# Altium project Sensorbox.PrjPCB (part 1 of 2)
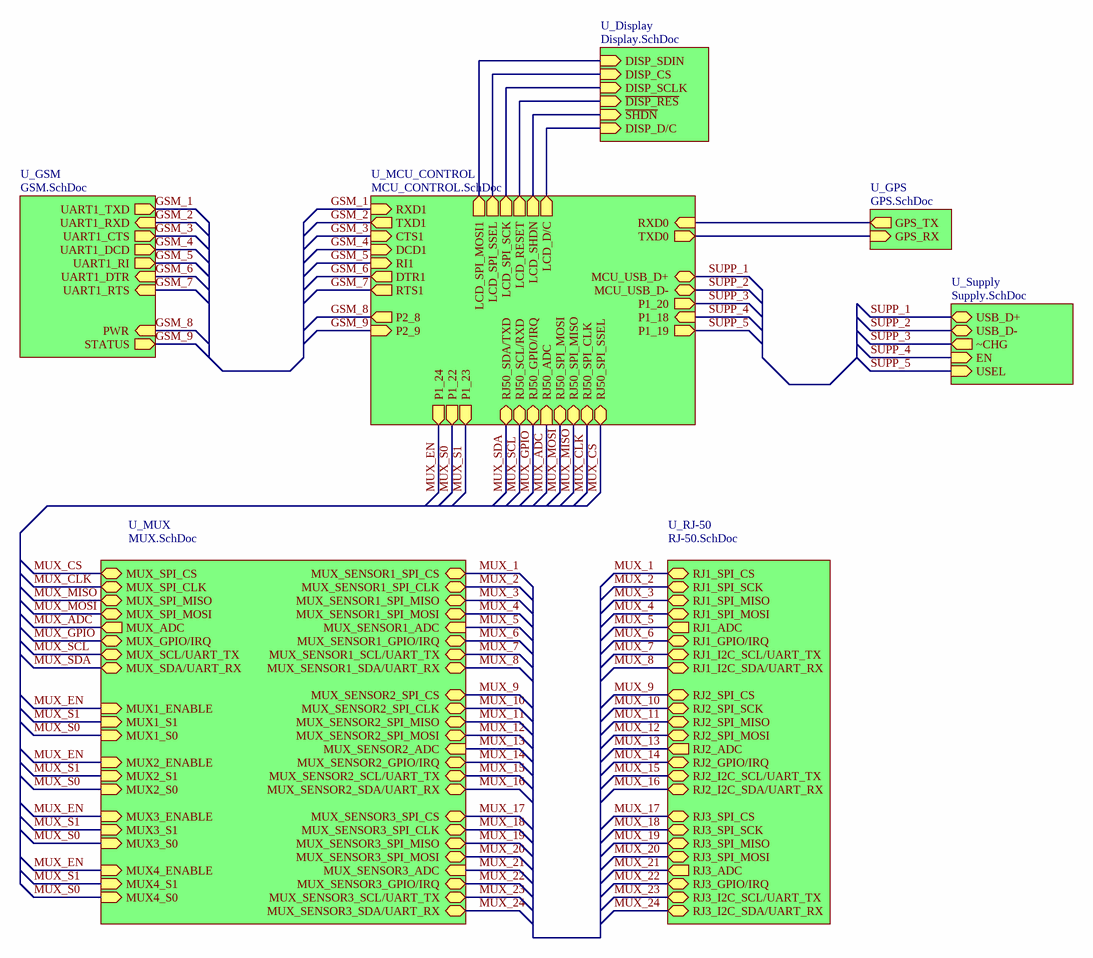
[diagram p0: Main_Scheet.SchDoc]
8 sheets, 160 parts. Net scope: hierarchical (ports join the sheet entries above them; power ports are global).
Board file: MeasureBox.PcbDoc
Sheets:
  Main_Scheet.SchDoc
    U_Supply = Supply.SchDoc
    U_RJ-50 = RJ-50.SchDoc
    U_MUX = MUX.SchDoc
    U_MCU_CONTROL = MCU_CONTROL.SchDoc
    U_GPS = GPS.SchDoc
    U_GSM = GSM.SchDoc
    U_Display = Display.SchDoc

## Sheet Main_Scheet.SchDoc: Main sheet
size 420 x 297 mm; DocumentNumber: 2; SheetNumber: 2; SheetTotal: 8

### Sub-sheets
U_Display = Display.SchDoc: ~{SHDN} (in), DISP_CS (in), ~{DISP_RES} (in), DISP_D/C (in), DISP_SCLK (in), DISP_SDIN (in)
U_GPS = GPS.SchDoc: GPS_RX (in), GPS_TX (out)
U_GSM = GSM.SchDoc: UART1_DCD (out), UART1_TXD (out), UART1_DTR (in), UART1_RI (out), UART1_RTS (in), UART1_RXD (in), UART1_CTS (out), STATUS (out), PWR (in)
U_MCU_CONTROL = MCU_CONTROL.SchDoc: TXD1 (out), RXD1 (in), CTS1 (in), DCD1 (in), DTR1 (out), RI1 (in), RTS1 (out), RXD0 (in), TXD0 (out), MCU_USB_D+ (bidir), MCU_USB_D- (bidir), P2_8 (out), RJ50_SPI_SSEL (bidir), P1_18 (in), P1_19 (out), P1_20 (out), RJ50_SCL/RXD (bidir), RJ50_SDA/TXD (bidir), RJ50_SPI_CLK (bidir), RJ50_SPI_MISO (bidir), RJ50_SPI_MOSI (bidir), RJ50_GPIO/IRQ (bidir), RJ50_ADC (in), P1_22 (out), P1_23 (out), P1_24 (out), P2_9 (in), LCD_D/C (out), LCD_RESET (out), LCD_SPI_SSEL (out), LCD_SPI_MOSI1 (out), LCD_SHDN (out), LCD_SPI_SCK (out)
U_MUX = MUX.SchDoc: MUX_SPI_CS (bidir), MUX_SENSOR1_SPI_CS (bidir), MUX_SENSOR2_SPI_CS (bidir), MUX_SENSOR3_SPI_CS (bidir), MUX_SENSOR1_SPI_CLK (bidir), MUX_SENSOR2_SPI_CLK (bidir), MUX_SENSOR3_SPI_CLK (bidir), MUX_SPI_CLK (bidir), MUX1_ENABLE (in), MUX1_S1 (in), MUX1_S0 (in), MUX_SPI_MISO (bidir), MUX_SENSOR1_SPI_MISO (bidir), MUX_SENSOR2_SPI_MISO (bidir), MUX_SENSOR3_SPI_MISO (bidir), MUX_SENSOR1_SPI_MOSI (bidir), MUX_SENSOR2_SPI_MOSI (bidir), MUX_SENSOR3_SPI_MOSI (bidir), MUX_SPI_MOSI (bidir), MUX2_ENABLE (in), MUX2_S1 (in), MUX2_S0 (in), MUX_ADC (out), MUX_SENSOR1_ADC (in), MUX_SENSOR2_ADC (in), MUX_SENSOR3_ADC (in), MUX_SENSOR1_GPIO/IRQ (bidir), MUX_SENSOR2_GPIO/IRQ (bidir), MUX_SENSOR3_GPIO/IRQ (bidir), MUX_GPIO/IRQ (bidir), MUX3_ENABLE (in), MUX3_S1 (in), MUX3_S0 (in), MUX_SCL/UART_TX (bidir), MUX_SENSOR1_SCL/UART_TX (bidir), MUX_SENSOR2_SCL/UART_TX (bidir), MUX_SENSOR3_SCL/UART_TX (bidir), MUX_SENSOR1_SDA/UART_RX (bidir), MUX_SENSOR2_SDA/UART_RX (bidir), MUX_SENSOR3_SDA/UART_RX (bidir), MUX_SDA/UART_RX (bidir), MUX4_ENABLE (in), MUX4_S1 (in), MUX4_S0 (in)
U_RJ-50 = RJ-50.SchDoc: RJ1_SPI_CS (bidir), RJ1_SPI_SCK (bidir), RJ1_SPI_MISO (bidir), RJ1_SPI_MOSI (bidir), RJ1_ADC (out), RJ1_I2C_SCL/UART_TX (bidir), RJ1_I2C_SDA/UART_RX (bidir), RJ1_GPIO/IRQ (bidir), RJ2_SPI_CS (bidir), RJ2_SPI_SCK (bidir), RJ2_SPI_MISO (bidir), RJ2_SPI_MOSI (bidir), RJ2_ADC (out), RJ2_I2C_SCL/UART_TX (bidir), RJ2_I2C_SDA/UART_RX (bidir), RJ2_GPIO/IRQ (bidir), RJ3_SPI_CS (bidir), RJ3_SPI_SCK (bidir), RJ3_SPI_MISO (bidir), RJ3_SPI_MOSI (bidir), RJ3_ADC (out), RJ3_I2C_SCL/UART_TX (bidir), RJ3_I2C_SDA/UART_RX (bidir), RJ3_GPIO/IRQ (bidir)
U_Supply = Supply.SchDoc: ~CHG (out), USEL (in), EN (in), USB_D- (bidir), USB_D+ (bidir)

### Nets
GSM_1: sheet U_MCU_CONTROL/RXD1, sheet U_GSM/UART1_TXD
GSM_2: sheet U_MCU_CONTROL/TXD1, sheet U_GSM/UART1_RXD
GSM_3: sheet U_MCU_CONTROL/CTS1, sheet U_GSM/UART1_CTS
GSM_4: sheet U_MCU_CONTROL/DCD1, sheet U_GSM/UART1_DCD
GSM_5: sheet U_MCU_CONTROL/RI1, sheet U_GSM/UART1_RI
GSM_6: sheet U_MCU_CONTROL/DTR1, sheet U_GSM/UART1_DTR
GSM_7: sheet U_MCU_CONTROL/RTS1, sheet U_GSM/UART1_RTS
GSM_8: sheet U_MCU_CONTROL/P2_8, sheet U_GSM/PWR
GSM_9: sheet U_MCU_CONTROL/P2_9, sheet U_GSM/STATUS
MUX_1: sheet U_RJ-50/RJ1_SPI_CS, sheet U_MUX/MUX_SENSOR1_SPI_CS
MUX_2: sheet U_RJ-50/RJ1_SPI_SCK, sheet U_MUX/MUX_SENSOR1_SPI_CLK
MUX_3: sheet U_RJ-50/RJ1_SPI_MISO, sheet U_MUX/MUX_SENSOR1_SPI_MISO
MUX_4: sheet U_RJ-50/RJ1_SPI_MOSI, sheet U_MUX/MUX_SENSOR1_SPI_MOSI
MUX_5: sheet U_RJ-50/RJ1_ADC, sheet U_MUX/MUX_SENSOR1_ADC
MUX_6: sheet U_RJ-50/RJ1_GPIO/IRQ, sheet U_MUX/MUX_SENSOR1_GPIO/IRQ
MUX_7: sheet U_RJ-50/RJ1_I2C_SCL/UART_TX, sheet U_MUX/MUX_SENSOR1_SCL/UART_TX
MUX_8: sheet U_RJ-50/RJ1_I2C_SDA/UART_RX, sheet U_MUX/MUX_SENSOR1_SDA/UART_RX
MUX_9: sheet U_RJ-50/RJ2_SPI_CS, sheet U_MUX/MUX_SENSOR2_SPI_CS
MUX_10: sheet U_RJ-50/RJ2_SPI_SCK, sheet U_MUX/MUX_SENSOR2_SPI_CLK
MUX_11: sheet U_RJ-50/RJ2_SPI_MISO, sheet U_MUX/MUX_SENSOR2_SPI_MISO
MUX_12: sheet U_RJ-50/RJ2_SPI_MOSI, sheet U_MUX/MUX_SENSOR2_SPI_MOSI
MUX_13: sheet U_RJ-50/RJ2_ADC, sheet U_MUX/MUX_SENSOR2_ADC
MUX_14: sheet U_RJ-50/RJ2_GPIO/IRQ, sheet U_MUX/MUX_SENSOR2_GPIO/IRQ
MUX_15: sheet U_RJ-50/RJ2_I2C_SCL/UART_TX, sheet U_MUX/MUX_SENSOR2_SCL/UART_TX
MUX_16: sheet U_RJ-50/RJ2_I2C_SDA/UART_RX, sheet U_MUX/MUX_SENSOR2_SDA/UART_RX
MUX_17: sheet U_RJ-50/RJ3_SPI_CS, sheet U_MUX/MUX_SENSOR3_SPI_CS
MUX_18: sheet U_RJ-50/RJ3_SPI_SCK, sheet U_MUX/MUX_SENSOR3_SPI_CLK
MUX_19: sheet U_RJ-50/RJ3_SPI_MISO, sheet U_MUX/MUX_SENSOR3_SPI_MISO
MUX_20: sheet U_RJ-50/RJ3_SPI_MOSI, sheet U_MUX/MUX_SENSOR3_SPI_MOSI
MUX_21: sheet U_RJ-50/RJ3_ADC, sheet U_MUX/MUX_SENSOR3_ADC
MUX_22: sheet U_RJ-50/RJ3_GPIO/IRQ, sheet U_MUX/MUX_SENSOR3_GPIO/IRQ
MUX_23: sheet U_RJ-50/RJ3_I2C_SCL/UART_TX, sheet U_MUX/MUX_SENSOR3_SCL/UART_TX
MUX_24: sheet U_RJ-50/RJ3_I2C_SDA/UART_RX, sheet U_MUX/MUX_SENSOR3_SDA/UART_RX
MUX_ADC: sheet U_MUX/MUX_ADC, sheet U_MCU_CONTROL/RJ50_ADC
MUX_CLK: sheet U_MUX/MUX_SPI_CLK, sheet U_MCU_CONTROL/RJ50_SPI_CLK
MUX_CS: sheet U_MUX/MUX_SPI_CS, sheet U_MCU_CONTROL/RJ50_SPI_SSEL
MUX_EN: sheet U_MUX/MUX1_ENABLE, sheet U_MUX/MUX2_ENABLE, sheet U_MUX/MUX3_ENABLE, sheet U_MUX/MUX4_ENABLE, sheet U_MCU_CONTROL/P1_24
MUX_GPIO: sheet U_MUX/MUX_GPIO/IRQ, sheet U_MCU_CONTROL/RJ50_GPIO/IRQ
MUX_MISO: sheet U_MUX/MUX_SPI_MISO, sheet U_MCU_CONTROL/RJ50_SPI_MISO
MUX_MOSI: sheet U_MUX/MUX_SPI_MOSI, sheet U_MCU_CONTROL/RJ50_SPI_MOSI
MUX_S0: sheet U_MUX/MUX1_S0, sheet U_MUX/MUX2_S0, sheet U_MUX/MUX3_S0, sheet U_MUX/MUX4_S0, sheet U_MCU_CONTROL/P1_22
MUX_S1: sheet U_MUX/MUX1_S1, sheet U_MUX/MUX2_S1, sheet U_MUX/MUX3_S1, sheet U_MUX/MUX4_S1, sheet U_MCU_CONTROL/P1_23
MUX_SCL: sheet U_MUX/MUX_SCL/UART_TX, sheet U_MCU_CONTROL/RJ50_SCL/RXD
MUX_SDA: sheet U_MUX/MUX_SDA/UART_RX, sheet U_MCU_CONTROL/RJ50_SDA/TXD
SUPP_1: sheet U_Supply/USB_D+, sheet U_MCU_CONTROL/MCU_USB_D+
SUPP_2: sheet U_Supply/USB_D-, sheet U_MCU_CONTROL/MCU_USB_D-
SUPP_3: sheet U_Supply/~CHG, sheet U_MCU_CONTROL/P1_20
SUPP_4: sheet U_Supply/EN, sheet U_MCU_CONTROL/P1_18
SUPP_5: sheet U_Supply/USEL, sheet U_MCU_CONTROL/P1_19
NetC42_2: sheet U_MCU_CONTROL/LCD_SHDN, sheet U_Display/~{SHDN}
NetCon4_8: sheet U_MCU_CONTROL/LCD_SPI_SSEL, sheet U_Display/DISP_CS
NetCon4_9: sheet U_MCU_CONTROL/LCD_RESET, sheet U_Display/~{DISP_RES}
NetCon4_10: sheet U_MCU_CONTROL/LCD_D/C, sheet U_Display/DISP_D/C
NetCon4_13: sheet U_MCU_CONTROL/LCD_SPI_SCK, sheet U_Display/DISP_SCLK
NetCon4_14: sheet U_MCU_CONTROL/LCD_SPI_MOSI1, sheet U_Display/DISP_SDIN
NetR48_2: sheet U_MCU_CONTROL/TXD0, sheet U_GPS/GPS_RX
NetR49_2: sheet U_MCU_CONTROL/RXD0, sheet U_GPS/GPS_TX

### Notes on the sheet
- Project/Equipment
- Document
- Sensorbox
- Designer
- Drawn by
- Check.by
- Copyright Creotech Instruments SA 2014.
  This documentation describes Open Hardware and is licensed under the CERN OHL v.1.1. You may redistribute and modify this documentation under the terms of the CERN OHL v.1.1. (http://ohwr.org/CERNOHL). This documentation is distributed WITHOUT ANY EXPRESS OR IMPLIED WARRANTY, INCLUDING OF MERCHANTABILITY, SATISFACTORY QUALITY AND FITNESS FOR A PARTICULAR PURPOSE. Please see the CERN OHL v.1.1 for applicable conditions.
- CTI
- Creotech Instruments S.A.
- File
- Last Mod.
- Print Date
- Sheet
- Size
- A3
- of
- Rev

## Sheet Supply.SchDoc: Supply
size 420 x 297 mm; DocumentNumber: 6; SheetNumber: 6; SheetTotal: 8
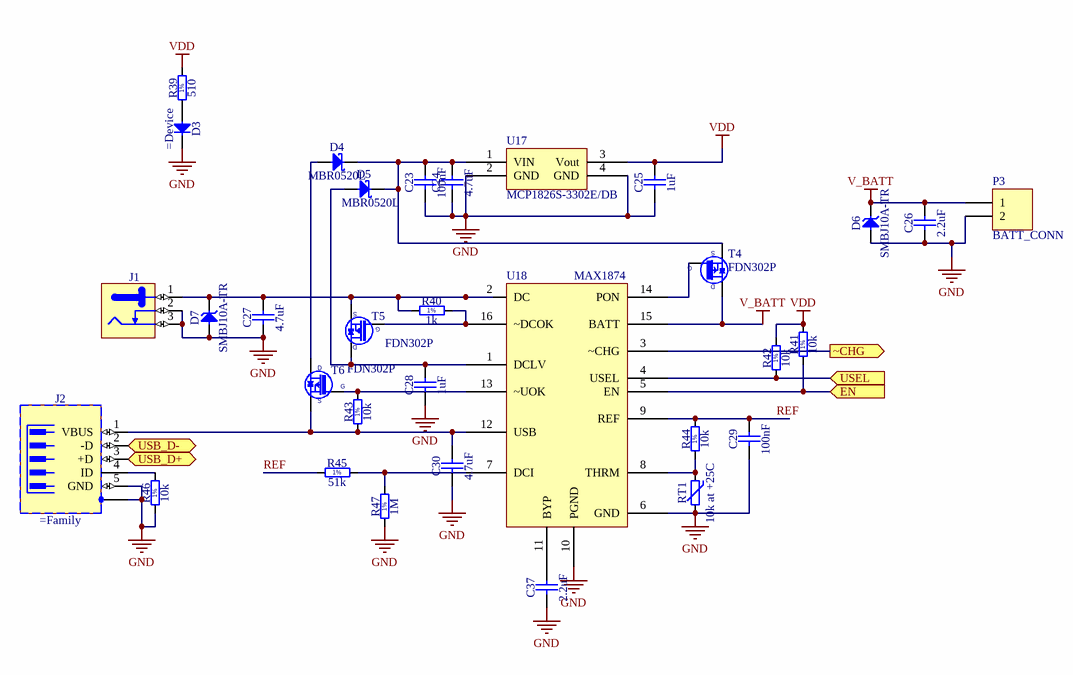
[diagram p1: Supply.SchDoc]

### Parts
C23  100nF  [CAPC1608X87N]
C24  4.7uF  [CAPC1608X87N]
C25  1uF  [CAPC1608X87N]
C26  2.2uF  [CAPC1608X87N]
C27  4.7uF  [CAPC1608X87N]
C28  1uF  [CAPC1608X87N]
C29  100nF  [CAPC1608X87N]
C30  4.7uF  [CAPC1608X87N]
C37  2.2uF  [CAPC1608X87N]
D3  (no value)  [LED_DIODE_0603]
D4  MBR0520L  [SCHOTTKY_SOD123]
D5  MBR0520L  [SCHOTTKY_SOD123]
D6  SMBJ10A-TR  [DO-214AA]
D7  SMBJ10A-TR  [DO-214AA]
J1  Jack  [CLIFF_FC68148(DC-10A)]  (value not drawn)
J2  (no value)  [Micro USB]
P3  BATT_CONN  [HDR1X2]
R39  510  [RESC1608X55N]
R40  1k  [RESC1608X55N]
R41  10k  [RESC1608X55N]
R42  10k  [RESC1608X55N]
R43  10k  [RESC1608X55N]
R44  10k  [RESC1608X55N]
R45  51k  [RESC1608X55N]
R46  10k  [RESC1608X55N]
R47  1M  [RESC1608X55N]
RT1  10k at +25C  [termistor]
T4  FDN302P  [FDN302P]
T5  FDN302P  [FDN302P]
T6  FDN302P  [FDN302P]
U17  MCP1826S-3302E/DB  [MCP1826S-3302E/DB]
U18  MAX1874  [TQFN 5x5/16-l]

### Ports
EN (in), USB_D+ (bidir), USB_D- (bidir), USEL (in), ~CHG (out)

### Nets
GND: C23.1 C24.1 C25.1 C26.1 C27.1 C28.1 C29.1 C30.1 C37.1 D3.1(C) D6.2(A) D7.2(A) J1.2 J1.3 J2.5(GND) J2.6(SH) P3.2 R46.1 R47.1 RT1.1 U17.2(GND) U17.4(GND) U18.6(GND) U18.10(PGND)
V_BATT: C26.2 D6.1(C) P3.1 T4.3(D) U18.15(BATT)
VDD: C25.2 R39.2 R41.2 R42.2 U17.3(Vout)
REF: C29.2 R44.2 R45.1 U18.9(REF)
SUPP_1: J2.3(+D) ; port USB_D+
SUPP_2: J2.2(-D) ; port USB_D-
SUPP_3: U18.3(~CHG) ; port ~CHG
SUPP_4: R41.1 U18.5(EN) ; port EN
SUPP_5: R42.1 U18.4(USEL) ; port USEL
NetC23_2: C23.2 C24.2 D4.1(C) D5.1(C) T4.2(S) U17.1(VIN)
NetC27_2: C27.2 D7.1(C) J1.1 R40.1 T5.2(S) U18.2(DC)
NetC28_2: C28.2 D5.2(A) T5.3(D) U18.1(DCLV)
NetC30_2: C30.2 J2.1(VBUS) R43.1 T6.2(S) U18.12(USB)
NetC37_2: C37.2 U18.11(BYP)
NetD3_2: D3.2(A) R39.1
NetD4_2: D4.2(A) T6.3(D)
NetJ2_4: J2.4(ID) R46.2
NetR40_2: R40.2 T5.1(G) U18.16(~DCOK)
NetR43_2: R43.2 T6.1(G) U18.13(~UOK)
NetR44_1: R44.1 RT1.2 U18.8(THRM)
NetR45_2: R45.2 R47.2 U18.7(DCI)
NetT4_1: T4.1(G) U18.14(PON)

### Notes on the sheet
- Project/Equipment
- Document
- Sensorbox
- Designer
- Drawn by
- Check.by
- Copyright Creotech Instruments SA 2014.
  This documentation describes Open Hardware and is licensed under the CERN OHL v.1.1. You may redistribute and modify this documentation under the terms of the CERN OHL v.1.1. (http://ohwr.org/CERNOHL). This documentation is distributed WITHOUT ANY EXPRESS OR IMPLIED WARRANTY, INCLUDING OF MERCHANTABILITY, SATISFACTORY QUALITY AND FITNESS FOR A PARTICULAR PURPOSE. Please see the CERN OHL v.1.1 for applicable conditions.
- CTI
- Creotech Instruments S.A.
- File
- Last Mod.
- Print Date
- Sheet
- Size
- A3
- of
- Rev
- (in symbol R0603_1K_1%_0.1W_100PPM) 1%
- (in symbol R0603_1M_1%_0.1W_100PPM) 1%
- (in symbol R0603_10K_1%_0.1W_100PPM) 1%
- (in symbol R0603_51K_1%_0.1W_100PPM) 1%
- (in symbol R0603_510R_1%_0.1W_100PPM) 1%

### Library data of the parts
C23 C29 = CC0603_100NF_50V_10%_X7R: Non-polarised capacitor; Part Description: SMD Multilayer Chip Ceramic Capacitor; Manufacturer: GENERIC; Manufacturer1 Part Number: 223858615649; Voltage: 50V; TC: X7R; Tolerance: ±10%; Table: Capacitors SMD; Part Number: CC0603_100NF_50V_10%_X7R; Component Kind: Standard; Component Type: Standard; Pin Count: 2; Value: 100nF; Status: Preferred; Manufacturer Part Number: CC0603_100NF_50V_10%_X7R; Case: 0603; Mounted: Yes; Socket: No; SMD: Yes; Manufacturer1 Example: PHYCOMP; Manufacturer1 ComponentHeight: 0.87mm; HelpURL: \\cern.ch\dfs\Applications\Altium\Datasheets\CC0603_X7R_PHYCOMP.pdf; Author: CERN DEM JLC; CreateDate: 2007-12-03; LatestRevisionDate: 2007-12-03
C24 C30 = CC0603_4.7UF_6.3V_10%_X5R: Non-polarised capacitor; Part Description: SMD Multilayer Chip Ceramic Capacitor; Manufacturer: GENERIC; Manufacturer1 Part Number: 225520613672; Voltage: 6.3V; TC: X5R; Tolerance: ±10%; Table: Capacitors SMD; Part Number: CC0603_4.7UF_6.3V_10%_X5R; Component Kind: Standard; Component Type: Standard; Pin Count: 2; Value: 4.7uF; Status: Preferred; Manufacturer Part Number: CC0603_4.7uF_6.3V_10%_X5R; Case: 0603; Mounted: Yes; Socket: No; SMD: Yes; Manufacturer1 Example: PHYCOMP; Manufacturer1 ComponentHeight: 0.87mm; HelpURL: \\cern.ch\dfs\Applications\Altium\Datasheets\CC0805_X5R_PHYCOMP_HC.pdf; Author: CERN DEM JLC; CreateDate: 2007-12-03; LatestRevisionDate: 2007-12-03
C25 C28 = CC0603_1UF_16V_10%_X7R: Non-polarised capacitor; Part Description: SMD Multilayer Chip Ceramic Capacitor; Manufacturer: GENERIC; Manufacturer1 Part Number: 223824613663; Voltage: 16V; TC: X7R; Tolerance: ±10%; Table: Capacitors SMD; Part Number: CC0603_1UF_16V_10%_X7R; Component Kind: Standard; Component Type: Standard; Pin Count: 2; Value: 1uF; Status: Preferred; Manufacturer Part Number: CC0603_1uF_16V_10%_X7R; Case: 0603; Mounted: Yes; Socket: No; SMD: Yes; Manufacturer1 Example: PHYCOMP; Manufacturer1 ComponentHeight: 0.87mm; HelpURL: \\cern.ch\dfs\Applications\Altium\Datasheets\CC0805_X5R_PHYCOMP_HC.pdf; Author: CERN DEM JLC; CreateDate: 2007-12-03; LatestRevisionDate: 2007-12-03
C26 = CC0603_2.2UF_6.3V_10%_X5R: Non-polarised capacitor; Part Description: SMD Multilayer Chip Ceramic Capacitor; Manufacturer: GENERIC; Manufacturer1 Part Number: 225520613667; Voltage: 6.3V; TC: X5R; Tolerance: ±10%; Table: Capacitors SMD; Part Number: CC0603_2.2UF_6.3V_10%_X5R; Component Kind: Standard; Component Type: Standard; Pin Count: 2; Value: 2.2uF; Status: Preferred; Manufacturer Part Number: CC0603_2.2uF_6.3V_10%_X5R; Case: 0603; Mounted: Yes; Socket: No; SMD: Yes; Manufacturer1 Example: PHYCOMP; Manufacturer1 ComponentHeight: 0.87mm; HelpURL: \\cern.ch\dfs\Applications\Altium\Datasheets\CC0805_X5R_PHYCOMP_HC.pdf; Author: CERN DEM JLC; CreateDate: 2007-12-03; LatestRevisionDate: 2007-12-03
C27 = CC0603_4.7UF_6.3V_10%_X5R: Non-polarised capacitor; Part Description: SMD Multilayer Chip Ceramic Capacitor; Manufacturer: GENERIC; Manufacturer1 Part Number: 225520613672; Voltage: 25V; TC: X5R; Tolerance: ±10%; Table: Capacitors SMD; Part Number: CC0603_4.7UF_6.3V_10%_X5R; Component Kind: Standard; Component Type: Standard; Pin Count: 2; Value: 4.7uF; Status: Preferred; Manufacturer Part Number: CC0603_4.7uF_6.3V_10%_X5R; Case: 0603; Mounted: Yes; Socket: No; SMD: Yes; Manufacturer1 Example: PHYCOMP; Manufacturer1 ComponentHeight: 0.87mm; HelpURL: \\cern.ch\dfs\Applications\Altium\Datasheets\CC0805_X5R_PHYCOMP_HC.pdf; Author: CERN DEM JLC; CreateDate: 2007-12-03; LatestRevisionDate: 2007-12-03
C37 = CC0603_2.2UF_16V_10%_X5R: Non-polarised capacitor; Part Description: SMD Multilayer Chip Ceramic Capacitor; Manufacturer: GENERIC; Manufacturer1 Part Number: CC0603KRX5R7BB225; Voltage: 16V; TC: X5R; Tolerance: ±10%; Table: Capacitors SMD; Part Number: CC0603_2.2UF_16V_10%_X5R; Component Kind: Standard; Component Type: Standard; Pin Count: 2; Value: 2.2uF; Status: Preferred; Manufacturer Part Number: CC0603_2.2UF_16V_10%_X5R; Case: 0603; Mounted: Yes; Socket: No; SMD: Yes; Manufacturer1 Example: YAGEO; Manufacturer1 ComponentHeight: 0.9mm; HelpURL: \\cern.ch\dfs\Applications\Altium\Datasheets\CC0805_X5R_PHYCOMP_HC.pdf; Author: CERN DEM JLC; CreateDate: 2011-04-28; LatestRevisionDate: 2011-04-28
D3 = Diode
D4 D5 = Diode Schottky: Schottky Diode
D6 D7 = Diode TVS Uni-Directional: Transient Voltage Suppressor Diode (Uni-Directional)
J1 = CLIFF_FC68148(DC-10A): 12V /  5A, 2.1mm Diameter Pin, DC Power Socket With  Switch. DC10A Type; Part Description: 12V/5A, 2.1mm Diameter Pin, DC Power Socket With  Switch (DC10A Type); Manufacturer: CLIFF ELECTRONIC COMPONENTS; Table: Miscellaneous; Part Number: CLIFF_FC68148(DC-10A); Component Kind: Standard; Component Type: Standard; Pin Count: 3; Family: Jack; Mounted: Yes; Socket: No; SMD: No; Status: None; Manufacturer Part Number: FC68148 (DC-10A); ComponentHeight: 11mm; HelpURL: \\cern.ch\dfs\Applications\Altium\Datasheets\CLIFF_FC68148(DC-10A).pdf; Author: CERN DEM JLC; CreateDate: 2010-11-23; LatestRevisionDate: 2010-11-23
J2 = Connector USB 5 Pin + 1Shield: MOLEX - 47346-0001 - MICRO USB TYPE B
P3 = Header 2: Header, 2-Pin; LatestRevisionDate: 17-Jul-2002; LatestRevisionNote: Re-released for DXP Platform.; Publisher: Altium Limited
R39 = R0603_510R_1%_0.1W_100PPM: Resistor - 1%; Part Description: General Purpose Thick Film Chip Resistor; Manufacturer: GENERIC; Manufacturer1 Part Number: NRC06F5100TRF; Power: 0.1W; TC: ±100ppm/°C; Table: Resistors SMD; Part Number: R0603_510R_1%_0.1W_100PPM; Component Kind: Standard; Component Type: Standard; Pin Count: 2; Value: 510; Status: Preferred; Tolerance: ±1%; Manufacturer Part Number: R0603_510R_1%_0.1W_100PPM; Case: 0603; Mounted: Yes; Socket: No; SMD: Yes; Manufacturer1 Example: NIC COMPONENT; Manufacturer1 ComponentHeight: 0.55mm; HelpURL: \\cern.ch\dfs\Applications\Altium\Datasheets\R0603_NIC_NRC.pdf; Author: CERN DEM JLC; CreateDate: 2007-12-03; LatestRevisionDate: 2008-03-13
R40 = R0603_1K_1%_0.1W_100PPM: Resistor - 1%; Part Description: General Purpose Thick Film Chip Resistor; Manufacturer: GENERIC; Manufacturer1 Part Number: NRC06F1001TRF; Power: 0.1W; TC: ±100ppm/°C; Table: Resistors SMD; Part Number: R0603_1K_1%_0.1W_100PPM; Component Kind: Standard; Component Type: Standard; Pin Count: 2; Value: 1k; Status: Preferred; Tolerance: ±1%; Manufacturer Part Number: R0603_1K_1%_0.1W_100PPM; Case: 0603; Mounted: Yes; Socket: No; SMD: Yes; Manufacturer1 Example: NIC COMPONENT; Manufacturer1 ComponentHeight: 0.55mm; HelpURL: \\cern.ch\dfs\Applications\Altium\Datasheets\R0603_NIC_NRC.pdf; Author: CERN DEM JLC; CreateDate: 2007-12-03; LatestRevisionDate: 2008-03-13
R41-R44 R46 = R0603_10K_1%_0.1W_100PPM: Resistor - 1%; Part Description: General Purpose Thick Film Chip Resistor; Manufacturer: GENERIC; Manufacturer1 Part Number: NRC06F1002TRF; Power: 0.1W; TC: ±100ppm/°C; Table: Resistors SMD; Part Number: R0603_10K_1%_0.1W_100PPM; Component Kind: Standard; Component Type: Standard; Pin Count: 2; Value: 10k; Status: Preferred; Tolerance: ±1%; Manufacturer Part Number: R0603_10K_1%_0.1W_100PPM; Case: 0603; Mounted: Yes; Socket: No; SMD: Yes; Manufacturer1 Example: NIC COMPONENT; Manufacturer1 ComponentHeight: 0.55mm; HelpURL: \\cern.ch\dfs\Applications\Altium\Datasheets\R0603_NIC_NRC.pdf; Author: CERN DEM JLC; CreateDate: 2007-12-03; LatestRevisionDate: 2008-03-13
R45 = R0603_51K_1%_0.1W_100PPM: Resistor - 1%; Part Description: General Purpose Thick Film Chip Resistor; Manufacturer: GENERIC; Manufacturer1 Part Number: NRC06F5102TRF; Power: 0.1W; TC: ±100ppm/°C; Table: Resistors SMD; Part Number: R0603_51K_1%_0.1W_100PPM; Component Kind: Standard; Component Type: Standard; Pin Count: 2; Value: 51k; Status: Preferred; Tolerance: ±1%; Manufacturer Part Number: R0603_51K_1%_0.1W_100PPM; Case: 0603; Mounted: Yes; Socket: No; SMD: Yes; Manufacturer1 Example: NIC COMPONENT; Manufacturer1 ComponentHeight: 0.55mm; HelpURL: \\cern.ch\dfs\Applications\Altium\Datasheets\R0603_NIC_NRC.pdf; Author: CERN DEM JLC; CreateDate: 2007-12-03; LatestRevisionDate: 2008-03-13
R47 = R0603_1M_1%_0.1W_100PPM: Resistor - 1%; Part Description: General Purpose Thick Film Chip Resistor; Manufacturer: GENERIC; Manufacturer1 Part Number: NRC06F1004TRF; Power: 0.1W; TC: ±100ppm/°C; Table: Resistors SMD; Part Number: R0603_1M_1%_0.1W_100PPM; Component Kind: Standard; Component Type: Standard; Pin Count: 2; Value: 1M; Status: Preferred; Tolerance: ±1%; Manufacturer Part Number: R0603_1M_1%_0.1W_100PPM; Case: 0603; Mounted: Yes; Socket: No; SMD: Yes; Manufacturer1 Example: NIC COMPONENT; Manufacturer1 ComponentHeight: 0.55mm; HelpURL: \\cern.ch\dfs\Applications\Altium\Datasheets\R0603_NIC_NRC.pdf; Author: CERN DEM JLC; CreateDate: 2007-12-03; LatestRevisionDate: 2008-03-13
RT1 = Thermistor NTC: Thermistor NTC (Negative Temperature Coefficient)
T4-T6 = P-MOS FDN302P: P-Channel 2.5V Specified PowerTrench? MOSFET
U17 = MCP1826S-3302E/DB Microchip LDO Regulator: Microchip LDO Regulator
U18 = MAX1874 - Battery charger: MAX1874 Dual input battery charger

## Sheet RJ-50.SchDoc: RJ-50
size 420 x 297 mm; DocumentNumber: 5; SheetNumber: 5; SheetTotal: 8
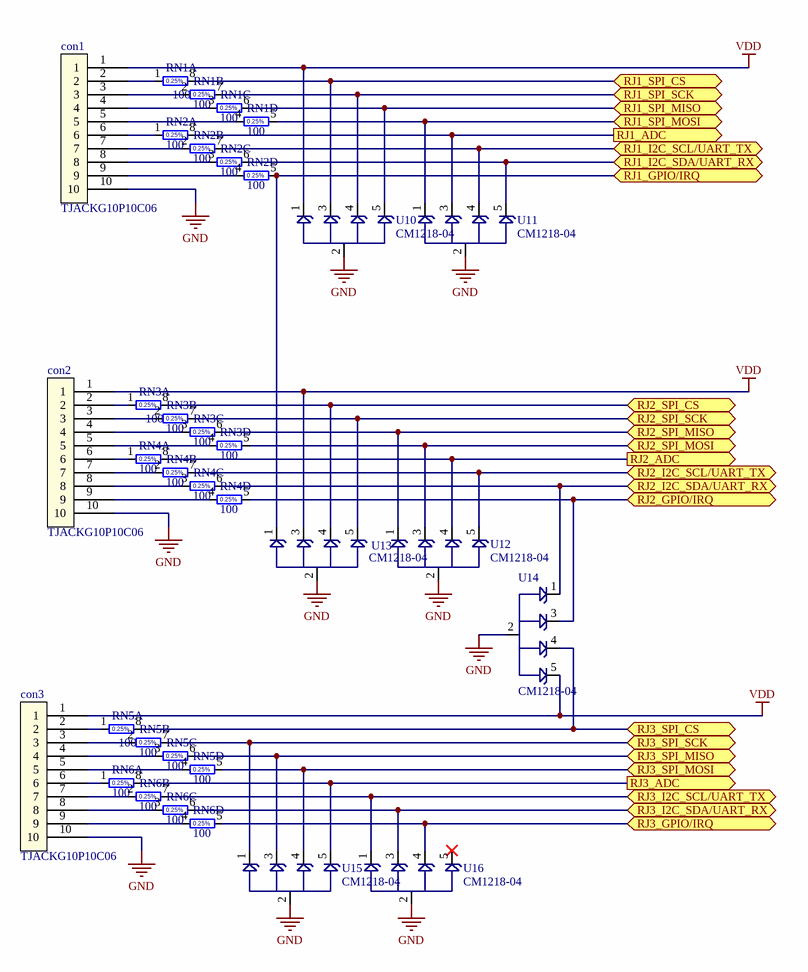
[diagram p2: RJ-50.SchDoc]

### Parts
con1  TJACKG10P10C06  [RJ-50 TJACKG10P10C06]
con2  TJACKG10P10C06  [RJ-50 TJACKG10P10C06]
con3  TJACKG10P10C06  [RJ-50 TJACKG10P10C06]
RN1  100  [RN_VISHAY_ACAS0612]  (parts A,B,C,D of 4)
RN2  100  [RN_VISHAY_ACAS0612]  (parts A,B,C,D of 4)
RN3  100  [RN_VISHAY_ACAS0612]  (parts A,B,C,D of 4)
RN4  100  [RN_VISHAY_ACAS0612]  (parts A,B,C,D of 4)
RN5  100  [RN_VISHAY_ACAS0612]  (parts A,B,C,D of 4)
RN6  100  [RN_VISHAY_ACAS0612]  (parts A,B,C,D of 4)
U10  CM1218-04  [ESD PROTECTOR]
U11  CM1218-04  [ESD PROTECTOR]
U12  CM1218-04  [ESD PROTECTOR]
U13  CM1218-04  [ESD PROTECTOR]
U14  CM1218-04  [ESD PROTECTOR]
U15  CM1218-04  [ESD PROTECTOR]
U16  CM1218-04  [ESD PROTECTOR]

### Ports
RJ1_ADC (out), RJ1_GPIO/IRQ (bidir), RJ1_I2C_SCL/UART_TX (bidir), RJ1_I2C_SDA/UART_RX (bidir), RJ1_SPI_CS (bidir), RJ1_SPI_MISO (bidir), RJ1_SPI_MOSI (bidir), RJ1_SPI_SCK (bidir), RJ2_ADC (out), RJ2_GPIO/IRQ (bidir), RJ2_I2C_SCL/UART_TX (bidir), RJ2_I2C_SDA/UART_RX (bidir), RJ2_SPI_CS (bidir), RJ2_SPI_MISO (bidir), RJ2_SPI_MOSI (bidir), RJ2_SPI_SCK (bidir), RJ3_ADC (out), RJ3_GPIO/IRQ (bidir), RJ3_I2C_SCL/UART_TX (bidir), RJ3_I2C_SDA/UART_RX (bidir), RJ3_SPI_CS (bidir), RJ3_SPI_MISO (bidir), RJ3_SPI_MOSI (bidir), RJ3_SPI_SCK (bidir)

### Nets
GND: con1.10 con2.10 con3.10 U10.2 U11.2 U12.2 U13.2 U14.2 U15.2 U16.2
VDD: con1.1 con2.1 con3.1 U10.1 U13.3 U14.5
MUX_1: RN1.8 U10.3 ; port RJ1_SPI_CS
MUX_2: RN1.7 U10.4 ; port RJ1_SPI_SCK
MUX_3: RN1.6 U10.5 ; port RJ1_SPI_MISO
MUX_4: RN1.5 U11.1 ; port RJ1_SPI_MOSI
MUX_5: RN2.8 U11.3 ; port RJ1_ADC
MUX_6: RN2.5 U13.1 ; port RJ1_GPIO/IRQ
MUX_7: RN2.7 U11.4 ; port RJ1_I2C_SCL/UART_TX
MUX_8: RN2.6 U11.5 ; port RJ1_I2C_SDA/UART_RX
MUX_9: RN3.8 U13.4 ; port RJ2_SPI_CS
MUX_10: RN3.7 U13.5 ; port RJ2_SPI_SCK
MUX_11: RN3.6 U12.1 ; port RJ2_SPI_MISO
MUX_12: RN3.5 U12.3 ; port RJ2_SPI_MOSI
MUX_13: RN4.8 U12.4 ; port RJ2_ADC
MUX_14: RN4.5 U14.3 ; port RJ2_GPIO/IRQ
MUX_15: RN4.7 U12.5 ; port RJ2_I2C_SCL/UART_TX
MUX_16: RN4.6 U14.1 ; port RJ2_I2C_SDA/UART_RX
MUX_17: RN5.8 U14.4 ; port RJ3_SPI_CS
MUX_18: RN5.7 U15.1 ; port RJ3_SPI_SCK
MUX_19: RN5.6 U15.3 ; port RJ3_SPI_MISO
MUX_20: RN5.5 U15.4 ; port RJ3_SPI_MOSI
MUX_21: RN6.8 U15.5 ; port RJ3_ADC
MUX_22: RN6.5 U16.4 ; port RJ3_GPIO/IRQ
MUX_23: RN6.7 U16.1 ; port RJ3_I2C_SCL/UART_TX
MUX_24: RN6.6 U16.3 ; port RJ3_I2C_SDA/UART_RX
Netcon1_2: con1.2 RN1.1
Netcon1_3: con1.3 RN1.2
Netcon1_4: con1.4 RN1.3
Netcon1_5: con1.5 RN1.4
Netcon1_6: con1.6 RN2.1
Netcon1_7: con1.7 RN2.2
Netcon1_8: con1.8 RN2.3
Netcon1_9: con1.9 RN2.4
Netcon2_2: con2.2 RN3.1
Netcon2_3: con2.3 RN3.2
Netcon2_4: con2.4 RN3.3
Netcon2_5: con2.5 RN3.4
Netcon2_6: con2.6 RN4.1
Netcon2_7: con2.7 RN4.2
Netcon2_8: con2.8 RN4.3
Netcon2_9: con2.9 RN4.4
Netcon3_2: con3.2 RN5.1
Netcon3_3: con3.3 RN5.2
Netcon3_4: con3.4 RN5.3
Netcon3_5: con3.5 RN5.4
Netcon3_6: con3.6 RN6.1
Netcon3_7: con3.7 RN6.2
Netcon3_8: con3.8 RN6.3
Netcon3_9: con3.9 RN6.4

Not connected (* = marked no-connect by the designer): U16 5*

### Notes on the sheet
- Project/Equipment
- Document
- Sensorbox
- Designer
- Drawn by
- Check.by
- Copyright Creotech Instruments SA 2014.
  This documentation describes Open Hardware and is licensed under the CERN OHL v.1.1. You may redistribute and modify this documentation under the terms of the CERN OHL v.1.1. (http://ohwr.org/CERNOHL). This documentation is distributed WITHOUT ANY EXPRESS OR IMPLIED WARRANTY, INCLUDING OF MERCHANTABILITY, SATISFACTORY QUALITY AND FITNESS FOR A PARTICULAR PURPOSE. Please see the CERN OHL v.1.1 for applicable conditions.
- CTI
- Creotech Instruments S.A.
- File
- Last Mod.
- Print Date
- Sheet
- Size
- A3
- of
- Rev
- (in symbol RN_100R_VISHAY_ACASA1000E1000P100, part A) 0.25%
- (in symbol RN_100R_VISHAY_ACASA1000E1000P100, part B) 0.25%
- (in symbol RN_100R_VISHAY_ACASA1000E1000P100, part C) 0.25%
- (in symbol RN_100R_VISHAY_ACASA1000E1000P100, part D) 0.25%

### Library data of the parts
con1-con3 = TJACKG10P10C06 (RJ50 - Female connector)
RN1-RN6 = RN_100R_VISHAY_ACASA1000E1000P100: DIL8 Resistor Network 4 Isolated Resistor 0.25%; Part Description: Chip Resistor Array , 4 Isolated Resistor (Convex Terminal), ACAS 0612 Serie; Manufacturer: VISHAY  BEYSCHLAG; Power: 0.1W; TC: ±25ppm/°C; Table: Resistor Networks SMD; Part Number: RN_100R_VISHAY_ACASA1000E1000P100; Component Kind: Standard; Component Type: Standard; Pin Count: 8; Value: 100; Tolerance: ±0.25%; Manufacturer Part Number: ACASA1000E1000P100; Case: 1206; Mounted: Yes; Socket: No; SMD: Yes; ComponentHeight: 0.55mm; HelpURL: \\cern.ch\dfs\Applications\Altium\Datasheets\RN_VISHAY_ACAS0612.pdf; Author: CERN DEM JLC; CreateDate: 2011-05-12; LatestRevisionDate: 2011-05-12
U10-U16 = CM1218-04 ESD_Protector

## Sheet MUX.SchDoc: MUX
size 420 x 297 mm; DocumentNumber: 4; SheetNumber: 4; SheetTotal: 8
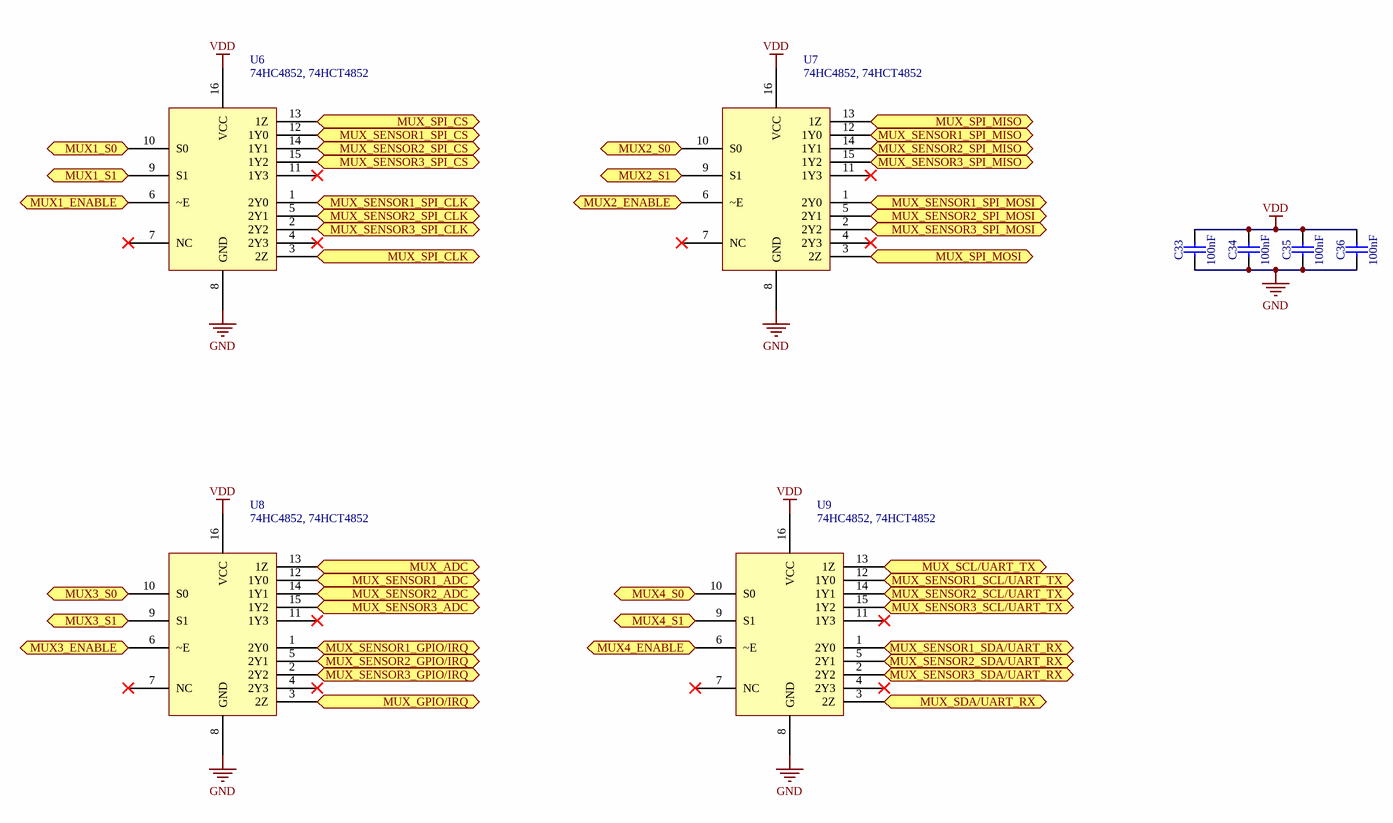
[diagram p3: MUX.SchDoc]

### Parts
C33  100nF  [CAPC1608X87N]
C34  100nF  [CAPC1608X87N]
C35  100nF  [CAPC1608X87N]
C36  100nF  [CAPC1608X87N]
U6  74HC4852, 74HCT4852  [TSSOP16]
U7  74HC4852, 74HCT4852  [TSSOP16]
U8  74HC4852, 74HCT4852  [TSSOP16]
U9  74HC4852, 74HCT4852  [TSSOP16]

### Ports
MUX1_ENABLE (in), MUX1_S0 (in), MUX1_S1 (in), MUX2_ENABLE (in), MUX2_S0 (in), MUX2_S1 (in), MUX3_ENABLE (in), MUX3_S0 (in), MUX3_S1 (in), MUX4_ENABLE (in), MUX4_S0 (in), MUX4_S1 (in), MUX_ADC (out), MUX_GPIO/IRQ (bidir), MUX_SCL/UART_TX (bidir), MUX_SDA/UART_RX (bidir), MUX_SENSOR1_ADC (in), MUX_SENSOR1_GPIO/IRQ (bidir), MUX_SENSOR1_SCL/UART_TX (bidir), MUX_SENSOR1_SDA/UART_RX (bidir), MUX_SENSOR1_SPI_CLK (bidir), MUX_SENSOR1_SPI_CS (bidir), MUX_SENSOR1_SPI_MISO (bidir), MUX_SENSOR1_SPI_MOSI (bidir), MUX_SENSOR2_ADC (in), MUX_SENSOR2_GPIO/IRQ (bidir), MUX_SENSOR2_SCL/UART_TX (bidir), MUX_SENSOR2_SDA/UART_RX (bidir), MUX_SENSOR2_SPI_CLK (bidir), MUX_SENSOR2_SPI_CS (bidir), MUX_SENSOR2_SPI_MISO (bidir), MUX_SENSOR2_SPI_MOSI (bidir), MUX_SENSOR3_ADC (in), MUX_SENSOR3_GPIO/IRQ (bidir), MUX_SENSOR3_SCL/UART_TX (bidir), MUX_SENSOR3_SDA/UART_RX (bidir), MUX_SENSOR3_SPI_CLK (bidir), MUX_SENSOR3_SPI_CS (bidir), MUX_SENSOR3_SPI_MISO (bidir), MUX_SENSOR3_SPI_MOSI (bidir), MUX_SPI_CLK (bidir), MUX_SPI_CS (bidir), MUX_SPI_MISO (bidir), MUX_SPI_MOSI (bidir)

### Nets
GND: C33.1 C34.1 C35.1 C36.1 U6.8(GND) U7.8(GND) U8.8(GND) U9.8(GND)
VDD: C33.2 C34.2 C35.2 C36.2 U6.16(VCC) U7.16(VCC) U8.16(VCC) U9.16(VCC)
MUX_1: U6.12(1Y0) ; port MUX_SENSOR1_SPI_CS
MUX_2: U6.1(2Y0) ; port MUX_SENSOR1_SPI_CLK
MUX_3: U7.12(1Y0) ; port MUX_SENSOR1_SPI_MISO
MUX_4: U7.1(2Y0) ; port MUX_SENSOR1_SPI_MOSI
MUX_5: U8.12(1Y0) ; port MUX_SENSOR1_ADC
MUX_6: U8.1(2Y0) ; port MUX_SENSOR1_GPIO/IRQ
MUX_7: U9.12(1Y0) ; port MUX_SENSOR1_SCL/UART_TX
MUX_8: U9.1(2Y0) ; port MUX_SENSOR1_SDA/UART_RX
MUX_9: U6.14(1Y1) ; port MUX_SENSOR2_SPI_CS
MUX_10: U6.5(2Y1) ; port MUX_SENSOR2_SPI_CLK
MUX_11: U7.14(1Y1) ; port MUX_SENSOR2_SPI_MISO
MUX_12: U7.5(2Y1) ; port MUX_SENSOR2_SPI_MOSI
MUX_13: U8.14(1Y1) ; port MUX_SENSOR2_ADC
MUX_14: U8.5(2Y1) ; port MUX_SENSOR2_GPIO/IRQ
MUX_15: U9.14(1Y1) ; port MUX_SENSOR2_SCL/UART_TX
MUX_16: U9.5(2Y1) ; port MUX_SENSOR2_SDA/UART_RX
MUX_17: U6.15(1Y2) ; port MUX_SENSOR3_SPI_CS
MUX_18: U6.2(2Y2) ; port MUX_SENSOR3_SPI_CLK
MUX_19: U7.15(1Y2) ; port MUX_SENSOR3_SPI_MISO
MUX_20: U7.2(2Y2) ; port MUX_SENSOR3_SPI_MOSI
MUX_21: U8.15(1Y2) ; port MUX_SENSOR3_ADC
MUX_22: U8.2(2Y2) ; port MUX_SENSOR3_GPIO/IRQ
MUX_23: U9.15(1Y2) ; port MUX_SENSOR3_SCL/UART_TX
MUX_24: U9.2(2Y2) ; port MUX_SENSOR3_SDA/UART_RX
MUX_ADC: U8.13(1Z) ; port MUX_ADC
MUX_CLK: U6.3(2Z) ; port MUX_SPI_CLK
MUX_CS: U6.13(1Z) ; port MUX_SPI_CS
MUX_EN: U6.6(~E) U7.6(~E) U8.6(~E) U9.6(~E) ; port MUX1_ENABLE, port MUX2_ENABLE, port MUX3_ENABLE, port MUX4_ENABLE
MUX_GPIO: U8.3(2Z) ; port MUX_GPIO/IRQ
MUX_MISO: U7.13(1Z) ; port MUX_SPI_MISO
MUX_MOSI: U7.3(2Z) ; port MUX_SPI_MOSI
MUX_S0: U6.10(S0) U7.10(S0) U8.10(S0) U9.10(S0) ; port MUX1_S0, port MUX2_S0, port MUX3_S0, port MUX4_S0
MUX_S1: U6.9(S1) U7.9(S1) U8.9(S1) U9.9(S1) ; port MUX1_S1, port MUX2_S1, port MUX3_S1, port MUX4_S1
MUX_SCL: U9.13(1Z) ; port MUX_SCL/UART_TX
MUX_SDA: U9.3(2Z) ; port MUX_SDA/UART_RX

Not connected (* = marked no-connect by the designer): U6 4(2Y3)* 7(NC)* 11(1Y3)*; U7 4(2Y3)* 7(NC)* 11(1Y3)*; U8 4(2Y3)* 7(NC)* 11(1Y3)*; U9 4(2Y3)* 7(NC)* 11(1Y3)*

### Notes on the sheet
- Project/Equipment
- Document
- Sensorbox
- Designer
- Drawn by
- Check.by
- Copyright Creotech Instruments SA 2014.
  This documentation describes Open Hardware and is licensed under the CERN OHL v.1.1. You may redistribute and modify this documentation under the terms of the CERN OHL v.1.1. (http://ohwr.org/CERNOHL). This documentation is distributed WITHOUT ANY EXPRESS OR IMPLIED WARRANTY, INCLUDING OF MERCHANTABILITY, SATISFACTORY QUALITY AND FITNESS FOR A PARTICULAR PURPOSE. Please see the CERN OHL v.1.1 for applicable conditions.
- CTI
- Creotech Instruments S.A.
- File
- Last Mod.
- Print Date
- Sheet
- Size
- A3
- of
- Rev

### Library data of the parts
C33-C36 = CC0603_100NF_50V_10%_X7R: as C23 on sheet Supply; Part Number: CC0603_100NF_50V_10%_X7R; Component Kind: Standard; Component Type: Standard; Pin Count: 2; Value: 100nF; Status: Preferred; Manufacturer Part Number: CC0603_100NF_50V_10%_X7R; Case: 0603; Mounted: Yes; Socket: No; SMD: Yes; Manufacturer1 Example: PHYCOMP; Manufacturer1 ComponentHeight: 0.87mm; HelpURL: \\cern.ch\dfs\Applications\Altium\Datasheets\CC0603_X7R_PHYCOMP.pdf; Author: CERN DEM JLC; CreateDate: 2007-12-03; LatestRevisionDate: 2007-12-03
U6-U9 = 74HC4852, 74HCT4852: NXP Analog Multiplexer/Demultiplexer

## Sheet MCU_CONTROL.SchDoc: MCU CONTROL
size 420 x 297 mm; DocumentNumber: 3; SheetNumber: 3; SheetTotal: 8
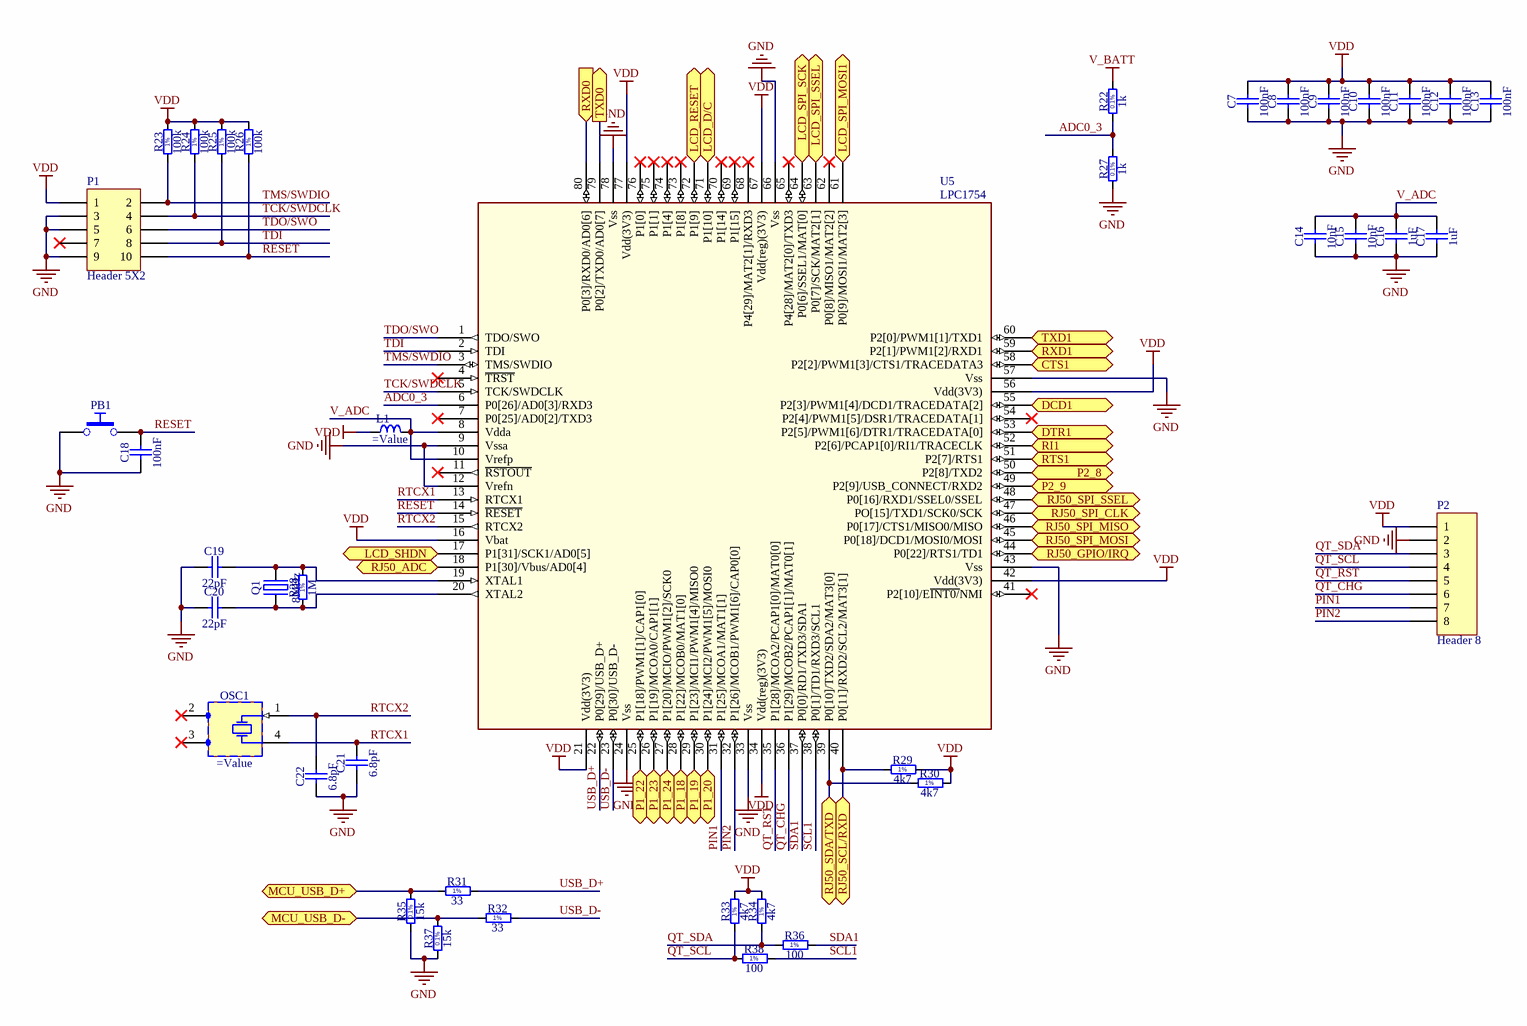
[diagram p4: MCU_CONTROL.SchDoc]

### Parts
C7  100nF  [CAPC1608X87N]
C8  100nF  [CAPC1608X87N]
C9  100nF  [CAPC1608X87N]
C10  100nF  [CAPC1608X87N]
C11  100nF  [CAPC1608X87N]
C12  100nF  [CAPC1608X87N]
C13  100nF  [CAPC1608X87N]
C14  10nF  [CAPC1608X87N]
C15  10nF  [CAPC1608X87N]
C16  1uF  [CAPC1608X87N]
C17  1uF  [CAPC1608X87N]
C18  100nF  [CAPC1608X87N]
C19  22pF  [CAPC1608X87N]
C20  22pF  [CAPC1608X87N]
C21  6.8pF  [CAPC1608X87N]
C22  6.8pF  [CAPC1608X87N]
L1  (no value)  [INDC1608X95N]
OSC1  (no value)  [85SMX CRYSTALS]
P1  Header 5X2  [HDR2X5]
P2  Header 8  [Pin_Head 2x4]
PB1  (no value)  [PB_TYCO_ALCOSWITCH_FSMSM]
Q1  8MHz  [XTAL_SMD]
R22  1k  [RESC1608X55N]
R23  100k  [RESC1608X55N]
R24  100k  [RESC1608X55N]
R25  100k  [RESC1608X55N]
R26  100k  [RESC1608X55N]
R27  1k  [RESC1608X55N]
R28  1M  [RESC1608X55N]
R29  4k7  [RESC1608X55N]
R30  4k7  [RESC1608X55N]
R31  33  [RESC1608X55N]
R32  33  [RESC1608X55N]
R33  4k7  [RESC1608X55N]
R34  4k7  [RESC1608X55N]
R35  15k  [RESC1608X55N]
R36  100  [RESC1608X55N]
R37  15k  [RESC1608X55N]
R38  100  [RESC1608X55N]
U5  LPC1754  [LQFP80]

### Ports
CTS1 (in), DCD1 (in), DTR1 (out), LCD_D/C (out), LCD_RESET (out), LCD_SHDN (out), LCD_SPI_MOSI1 (out), LCD_SPI_SCK (out), LCD_SPI_SSEL (out), MCU_USB_D+ (bidir), MCU_USB_D- (bidir), P1_18 (in), P1_19 (out), P1_20 (out), P1_22 (out), P1_23 (out), P1_24 (out), P2_8 (out), P2_9 (in), RI1 (in), RJ50_ADC (in), RJ50_GPIO/IRQ (bidir), RJ50_SCL/RXD (bidir), RJ50_SDA/TXD (bidir), RJ50_SPI_CLK (bidir), RJ50_SPI_MISO (bidir), RJ50_SPI_MOSI (bidir), RJ50_SPI_SSEL (bidir), RTS1 (out), RXD0 (in), RXD1 (in), TXD0 (out), TXD1 (out)

### Nets
GND: C7.1 C8.1 C9.1 C10.1 C11.1 C12.1 C13.1 C14.1 C15.1 C16.1 C17.1 C18.1 C19.1 C20.1 C21.1 C22.1 P1.3 P1.5 P1.9 P2.2 PB1.1 R27.1 R35.1 R37.1 U5.9(Vssa) U5.12(Vrefn) U5.24(Vss) U5.33(Vss) U5.43(Vss) U5.57(Vss) U5.66(Vss) U5.78(Vss)
V_BATT: R22.2
VDD: C7.2 C8.2 C9.2 C10.2 C11.2 C12.2 C13.2 L1.1 P1.1 P2.1 R23.2 R24.2 R25.2 R26.2 R29.2 R30.2 R33.2 R34.2 U5.16(Vbat) U5.21(Vdd(3V3)) U5.34(Vdd(reg)(3V3)) U5.42(Vdd(3V3)) U5.56(Vdd(3V3)) U5.67(Vdd(reg)(3V3)) U5.77(Vdd(3V3))
ADC0_3: R22.1 R27.2 U5.6(P0[26]/AD0[3]/RXD3)
GSM_1: U5.59(P2[1]/PWM1[2]/RXD1) ; port RXD1
GSM_2: U5.60(P2[0]/PWM1[1]/TXD1) ; port TXD1
GSM_3: U5.58(P2[2]/PWM1[3]/CTS1/TRACEDATA3) ; port CTS1
GSM_4: U5.55(P2[3]/PWM1[4]/DCD1/TRACEDATA[2]) ; port DCD1
GSM_5: U5.52(P2[6]/PCAP1[0]/RI1/TRACECLK) ; port RI1
GSM_6: U5.53(P2[5]/PWM1[6]/DTR1/TRACEDATA[0]) ; port DTR1
GSM_7: U5.51(P2[7]/RTS1) ; port RTS1
GSM_8: U5.50(P2[8]/TXD2) ; port P2_8
GSM_9: U5.49(P2[9]/USB_CONNECT/RXD2) ; port P2_9
MUX_ADC: U5.18(P1[30]/Vbus/AD0[4]) ; port RJ50_ADC
MUX_CLK: U5.47(PO[15]/TXD1/SCK0/SCK) ; port RJ50_SPI_CLK
MUX_CS: U5.48(P0[16]/RXD1/SSEL0/SSEL) ; port RJ50_SPI_SSEL
MUX_EN: U5.27(P1[20]/MCIO/PWM1[2]/SCK0) ; port P1_24
MUX_GPIO: U5.44(P0[22]/RTS1/TD1) ; port RJ50_GPIO/IRQ
MUX_MISO: U5.46(P0[17]/CTS1/MISO0/MISO) ; port RJ50_SPI_MISO
MUX_MOSI: U5.45(P0[18]/DCD1/MOSI0/MOSI) ; port RJ50_SPI_MOSI
MUX_S0: U5.25(P1[18]/PWM1[1]/CAP1[0]) ; port P1_22
MUX_S1: U5.26(P1[19]/MCOA0/CAP1[1]) ; port P1_23
MUX_SCL: R29.1 U5.40(P0[11]/RXD2/SCL2/MAT3[1]) ; port RJ50_SCL/RXD
MUX_SDA: R30.1 U5.39(P0[10]/TXD2/SDA2/MAT3[0]) ; port RJ50_SDA/TXD
PIN1: P2.7 U5.31(P1[25]/MCOA1/MAT1[1])
PIN2: P2.8 U5.32(P1[26]/MCOB1/PWM1[6]/CAP0[0])
QT_CHG: P2.6 U5.36(P1[29]/MCOB2/PCAP1[1]/MAT0[1])
QT_RST: P2.5 U5.35(P1[28]/MCOA2/PCAP1[0]/MAT0[0])
QT_SCL: P2.4 R33.1 R38.1
QT_SDA: P2.3 R34.1 R36.1
RESET: C18.2 P1.10 PB1.2 R26.1 U5.14(~{RESET})
RTCX1: C21.2 OSC1.4(X) U5.13(RTCX1)
RTCX2: C22.2 OSC1.1(X) U5.15(RTCX2)
SCL1: R38.2 U5.38(P0[1]/TD1/RXD3/SCL1)
SDA1: R36.2 U5.37(P0[0]/RD1/TXD3/SDA1)
SUPP_1: R31.1 R35.2 ; port MCU_USB_D+
SUPP_2: R32.1 R37.2 ; port MCU_USB_D-
SUPP_3: U5.30(P1[24]/MCI2/PWM1[5]/MOSI0) ; port P1_20
SUPP_4: U5.28(P1[22]/MCOB0/MAT1[0]) ; port P1_18
SUPP_5: U5.29(P1[23]/MCI1/PWM1[4]/MISO0) ; port P1_19
TCK/SWDCLK: P1.4 R24.1 U5.5(TCK/SWDCLK)
TDI: P1.8 R25.1 U5.2(TDI)
TDO/SWO: P1.6 U5.1(TDO/SWO)
TMS/SWDIO: P1.2 R23.1 U5.3(TMS/SWDIO)
USB_D+: R31.2 U5.22(P0[29]/USB_D+)
USB_D-: R32.2 U5.23(P0[30]/USB_D-)
V_ADC: C14.2 C15.2 C16.2 C17.2 L1.2 U5.8(Vdda) U5.10(Vrefp)
NetC19_2: C19.2 Q1.2(OSC2) R28.2 U5.19(XTAL1)
NetC20_2: C20.2 Q1.1(OSC1) R28.1 U5.20(XTAL2)
NetC42_2: U5.17(P1[31]/SCK1/AD0[5]) ; port LCD_SHDN
NetCon4_8: U5.63(P0[7]/SCK/MAT2[1]) ; port LCD_SPI_SSEL
NetCon4_9: U5.72(P1[9]) ; port LCD_RESET
NetCon4_10: U5.71(P1[10]) ; port LCD_D/C
NetCon4_13: U5.64(P0[6]/SSEL1/MAT[0]) ; port LCD_SPI_SCK
NetCon4_14: U5.61(P0[9]/MOSI1/MAT2[3]) ; port LCD_SPI_MOSI1
NetR48_2: U5.79(P0[2]/TXD0/AD0[7]) ; port TXD0
NetR49_2: U5.80(P0[3]/RXD0/AD0[6]) ; port RXD0

Not connected (* = marked no-connect by the designer): OSC1 2(GND)* 3(GND)*; P1 7*; U5 4(~{TRST})* 7(P0[25]/AD0[2]/TXD3)* 11(~{RSTOUT})* 41(P2[10]/E~{INT0}~{/}NMI)* 54(P2[4]/PWM1[5]/DSR1/TRACEDATA[1])* 62(P0[8]/MISO1/MAT2[2])* 65(P4[28]/MAT2[0]/TXD3)* 68(P4[29]/MAT2[1]/RXD3)* 69(P1[15])* 70(P1[14])* 73(P1[8])* 74(P1[4])* 75(P1[1])* 76(P1[0])*

### Notes on the sheet
- Project/Equipment
- Document
- Sensorbox
- Designer
- Drawn by
- Check.by
- Copyright Creotech Instruments SA 2014.
  This documentation describes Open Hardware and is licensed under the CERN OHL v.1.1. You may redistribute and modify this documentation under the terms of the CERN OHL v.1.1. (http://ohwr.org/CERNOHL). This documentation is distributed WITHOUT ANY EXPRESS OR IMPLIED WARRANTY, INCLUDING OF MERCHANTABILITY, SATISFACTORY QUALITY AND FITNESS FOR A PARTICULAR PURPOSE. Please see the CERN OHL v.1.1 for applicable conditions.
- CTI
- Creotech Instruments S.A.
- File
- Last Mod.
- Print Date
- Sheet
- Size
- A3
- of
- Rev
- (in symbol R0603_1K0_0.1%_0.063W_10PPM) 0.1%
- (in symbol R0603_1M_1%_0.1W_100PPM) 1%
- (in symbol R0603_4K7_1%_0.1W_100PPM) 1%
- (in symbol R0603_15K_0.1%_0.063W_10PPM) 0.1%
- (in symbol R0603_33R_1%_0.1W_100PPM) 1%
- (in symbol R0603_100K_1%_0.1W_100PPM) 1%
- (in symbol R0603_100R_1%_0.1W_100PPM) 1%

### Library data of the parts
C7-C13 C18 = CC0603_100NF_50V_10%_X7R: as C23 on sheet Supply; Part Number: CC0603_100NF_50V_10%_X7R; Component Kind: Standard; Component Type: Standard; Pin Count: 2; Value: 100nF; Status: Preferred; Manufacturer Part Number: CC0603_100NF_50V_10%_X7R; Case: 0603; Mounted: Yes; Socket: No; SMD: Yes; Manufacturer1 Example: PHYCOMP; Manufacturer1 ComponentHeight: 0.87mm; HelpURL: \\cern.ch\dfs\Applications\Altium\Datasheets\CC0603_X7R_PHYCOMP.pdf; Author: CERN DEM JLC; CreateDate: 2007-12-03; LatestRevisionDate: 2007-12-03
C14 C15 = CC0603_10NF_50V_10%_X7R: Non-polarised capacitor; Part Description: SMD Multilayer Chip Ceramic Capacitor; Manufacturer: GENERIC; Manufacturer1 Part Number: 223858615636; Voltage: 50V; TC: X7R; Tolerance: ±10%; Table: Capacitors SMD; Part Number: CC0603_10NF_50V_10%_X7R; Component Kind: Standard; Component Type: Standard; Pin Count: 2; Value: 10nF; Status: Preferred; Manufacturer Part Number: CC0603_10NF_50V_10%_X7R; Case: 0603; Mounted: Yes; Socket: No; SMD: Yes; Manufacturer1 Example: PHYCOMP; Manufacturer1 ComponentHeight: 0.87mm; HelpURL: \\cern.ch\dfs\Applications\Altium\Datasheets\CC0603_X7R_PHYCOMP.pdf; Author: CERN DEM JLC; CreateDate: 2007-12-03; LatestRevisionDate: 2007-12-03
C16 C17 = CC0603_1UF_16V_10%_X7R: as C25 on sheet Supply; Part Number: CC0603_1UF_16V_10%_X7R; Component Kind: Standard; Component Type: Standard; Pin Count: 2; Value: 1uF; Status: Preferred; Manufacturer Part Number: CC0603_1uF_16V_10%_X7R; Case: 0603; Mounted: Yes; Socket: No; SMD: Yes; Manufacturer1 Example: PHYCOMP; Manufacturer1 ComponentHeight: 0.87mm; HelpURL: \\cern.ch\dfs\Applications\Altium\Datasheets\CC0805_X5R_PHYCOMP_HC.pdf; Author: CERN DEM JLC; CreateDate: 2007-12-03; LatestRevisionDate: 2007-12-03
C19 C20 = CC0603_22PF_50V_5%_NP0: Non-polarised capacitor; Part Description: SMD Multilayer Chip Ceramic Capacitor; Manufacturer: GENERIC; Manufacturer1 Part Number: 223886715229; Voltage: 50V; TC: NP0; Tolerance: ±5%; Table: Capacitors SMD; Part Number: CC0603_22PF_50V_5%_NP0; Component Kind: Standard; Component Type: Standard; Pin Count: 2; Value: 22pF; Status: Preferred; Manufacturer Part Number: CC0603_22PF_50V_5%_NP0; Case: 0603; Mounted: Yes; Socket: No; SMD: Yes; Manufacturer1 Example: PHYCOMP; Manufacturer1 ComponentHeight: 0.87mm; HelpURL: \\cern.ch\dfs\Applications\Altium\Datasheets\CC0603_NP0_PHYCOMP.pdf; Author: CERN DEM JLC; CreateDate: 2007-12-03; LatestRevisionDate: 2007-12-03
C21 C22 = CC0603_6.8PF_50V_0.5PF_NP0: Non-polarised capacitor; Part Description: SMD Multilayer Chip Ceramic Capacitor; Manufacturer: GENERIC; Manufacturer1 Part Number: 223886715688; Voltage: 50V; TC: NP0; Tolerance: ±0.5pF; Table: Capacitors SMD; Part Number: CC0603_6.8PF_50V_0.5PF_NP0; Component Kind: Standard; Component Type: Standard; Pin Count: 2; Value: 6.8pF; Status: Preferred; Manufacturer Part Number: CC0603_6.8PF_50V_0.5PF_NP0; Case: 0603; Mounted: Yes; Socket: No; SMD: Yes; Manufacturer1 Example: PHYCOMP; Manufacturer1 ComponentHeight: 0.87mm; HelpURL: \\cern.ch\dfs\Applications\Altium\Datasheets\CC0603_NP0_PHYCOMP.pdf; Author: CERN DEM JLC; CreateDate: 2007-12-03; LatestRevisionDate: 2007-12-03
L1 = Inductor
OSC1 = Quartz Crystal 1X 2CASE 3CASE 4X: Crystal 4 pins 1=XTAL Control 2=CASE 3=CASE 4=XTAL
P1 = Header 5X2: Header, 5-Pin, Dual row; LatestRevisionDate: 17-Jul-2002; LatestRevisionNote: Re-released for DXP Platform.; Publisher: Altium Limited
P2 = Header 8: Header, 8-Pin; LatestRevisionDate: 17-Jul-2002; LatestRevisionNote: Re-released for DXP Platform.; Publisher: Altium Limited
PB1 = PB SPST 1NO-2NO: Push-Button Switch SPDT
Q1 = Quartz Crystal
R22 R27 = R0603_1K0_0.1%_0.063W_10PPM: Resistor - 0.1%; Part Description: Thin Film Chip Resistor; Manufacturer: GENERIC; Manufacturer1 Part Number: RN73C1J1K0BTDF; Power: 0.063W; TC: ±10ppm; Table: Resistors SMD; Part Number: R0603_1K0_0.1%_0.063W_10PPM; Component Kind: Standard; Component Type: Standard; Pin Count: 2; Value: 1k; Status: Not recommended; Tolerance: ±0.1%; Manufacturer Part Number: R0603_1K0_0.1%_0.063W_10PPM; Case: 0603; Mounted: Yes; Socket: No; SMD: Yes; Manufacturer1 Example: TYCO HOLSWORTHY; Manufacturer1 ComponentHeight: 0.5mm; HelpURL: \\cern.ch\dfs\Applications\Altium\Datasheets\R0603_Tyco_RN73.pdf; Author: CERN DEM JLC; CreateDate: 2007-12-03; LatestRevisionDate: 2008-03-13
R23-R26 = R0603_100K_1%_0.1W_100PPM: Resistor - 1%; Part Description: General Purpose Thick Film Chip Resistor; Manufacturer: GENERIC; Manufacturer1 Part Number: NRC06F1003TRF; Power: 0.1W; TC: ±100ppm/°C; Table: Resistors SMD; Part Number: R0603_100K_1%_0.1W_100PPM; Component Kind: Standard; Component Type: Standard; Pin Count: 2; Value: 100k; Status: Preferred; Tolerance: ±1%; Manufacturer Part Number: R0603_100K_1%_0.1W_100PPM; Case: 0603; Mounted: Yes; Socket: No; SMD: Yes; Manufacturer1 Example: NIC COMPONENT; Manufacturer1 ComponentHeight: 0.55mm; HelpURL: \\cern.ch\dfs\Applications\Altium\Datasheets\R0603_NIC_NRC.pdf; Author: CERN DEM JLC; CreateDate: 2007-12-03; LatestRevisionDate: 2008-03-13
R28 = R0603_1M_1%_0.1W_100PPM: as R47 on sheet Supply; Part Number: R0603_1M_1%_0.1W_100PPM; Component Kind: Standard; Component Type: Standard; Pin Count: 2; Value: 1M; Status: Preferred; Tolerance: ±1%; Manufacturer Part Number: R0603_1M_1%_0.1W_100PPM; Case: 0603; Mounted: Yes; Socket: No; SMD: Yes; Manufacturer1 Example: NIC COMPONENT; Manufacturer1 ComponentHeight: 0.55mm; HelpURL: \\cern.ch\dfs\Applications\Altium\Datasheets\R0603_NIC_NRC.pdf; Author: CERN DEM JLC; CreateDate: 2007-12-03; LatestRevisionDate: 2008-03-13
R29 R30 R33 R34 = R0603_4K7_1%_0.1W_100PPM: Resistor - 1%; Part Description: General Purpose Thick Film Chip Resistor; Manufacturer: GENERIC; Manufacturer1 Part Number: NRC06F4701TRF; Power: 0.1W; TC: ±100ppm/°C; Table: Resistors SMD; Part Number: R0603_4K7_1%_0.1W_100PPM; Component Kind: Standard; Component Type: Standard; Pin Count: 2; Value: 4k7; Status: Preferred; Tolerance: ±1%; Manufacturer Part Number: R0603_4K7_1%_0.1W_100PPM; Case: 0603; Mounted: Yes; Socket: No; SMD: Yes; Manufacturer1 Example: NIC COMPONENT; Manufacturer1 ComponentHeight: 0.55mm; HelpURL: \\cern.ch\dfs\Applications\Altium\Datasheets\R0603_NIC_NRC.pdf; Author: CERN DEM JLC; CreateDate: 2007-12-03; LatestRevisionDate: 2008-03-13
R31 R32 = R0603_33R_1%_0.1W_100PPM: Resistor - 1%; Part Description: General Purpose Thick Film Chip Resistor; Manufacturer: GENERIC; Manufacturer1 Part Number: NRC06F33R0TRF; Power: 0.1W; TC: ±100ppm/°C; Table: Resistors SMD; Part Number: R0603_33R_1%_0.1W_100PPM; Component Kind: Standard; Component Type: Standard; Pin Count: 2; Value: 33; Status: Preferred; Tolerance: ±1%; Manufacturer Part Number: R0603_33R_1%_0.1W_100PPM; Case: 0603; Mounted: Yes; Socket: No; SMD: Yes; Manufacturer1 Example: NIC COMPONENT; Manufacturer1 ComponentHeight: 0.55mm; HelpURL: \\cern.ch\dfs\Applications\Altium\Datasheets\R0603_NIC_NRC.pdf; Author: CERN DEM JLC; CreateDate: 2007-12-03; LatestRevisionDate: 2008-03-13
R35 R37 = R0603_15K_0.1%_0.063W_10PPM: Resistor - 0.1%; Part Description: Thin Film Chip Resistor; Manufacturer: GENERIC; Manufacturer1 Part Number: RN73C1J15KBTDF; Power: 0.063W; TC: ±10ppm; Table: Resistors SMD; Part Number: R0603_15K_0.1%_0.063W_10PPM; Component Kind: Standard; Component Type: Standard; Pin Count: 2; Value: 15k; Status: Not recommended; Tolerance: ±0.1%; Manufacturer Part Number: R0603_15K_0.1%_0.063W_10PPM; Case: 0603; Mounted: Yes; Socket: No; SMD: Yes; Manufacturer1 Example: TYCO HOLSWORTHY; Manufacturer1 ComponentHeight: 0.5mm; HelpURL: \\cern.ch\dfs\Applications\Altium\Datasheets\R0603_Tyco_RN73.pdf; Author: CERN DEM JLC; CreateDate: 2007-12-03; LatestRevisionDate: 2008-03-13
R36 R38 = R0603_100R_1%_0.1W_100PPM: Resistor - 1%; Part Description: General Purpose Thick Film Chip Resistor; Manufacturer: GENERIC; Manufacturer1 Part Number: NRC06F4700TRF; Power: 0.1W; TC: ±100ppm/°C; Table: Resistors SMD; Part Number: R0603_100R_1%_0.1W_100PPM; Component Kind: Standard; Component Type: Standard; Pin Count: 2; Value: 100; Status: Preferred; Tolerance: ±1%; Manufacturer Part Number: R0603_100R_1%_0.1W_100PPM; Case: 0603; Mounted: Yes; Socket: No; SMD: Yes; Manufacturer1 Example: NIC COMPONENT; Manufacturer1 ComponentHeight: 0.55mm; HelpURL: \\cern.ch\dfs\Applications\Altium\Datasheets\R0603_NIC_NRC.pdf; Author: CERN DEM JLC; CreateDate: 2007-12-03; LatestRevisionDate: 2008-03-13

## Sheet GPS.SchDoc: GPS
size 420 x 297 mm; DocumentNumber: 7; SheetNumber: 7; SheetTotal: 8
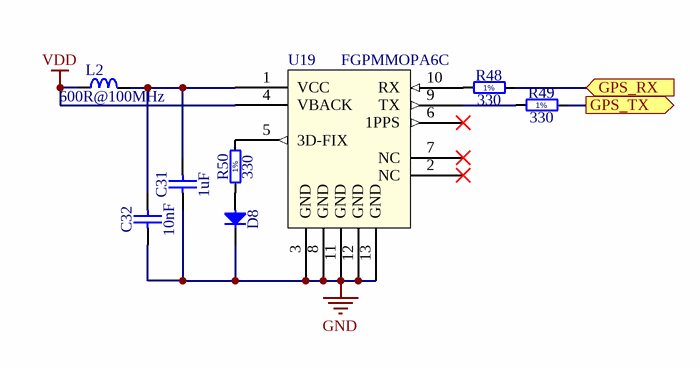
[diagram p5: GPS.SchDoc]

### Parts
C31  1uF  [CAPC1608X87N]
C32  10nF  [CAPC1608X87N]
D8  (no value)  [LED_DIODE_0603]
L2  600R@100MHz  [INDC1005X55N]
R48  330  [RESC1608X55N]
R49  330  [RESC1608X55N]
R50  330  [RESC1608X55N]
U19  FGPMMOPA6C  [GPS-FGPMMOPA6C]

### Ports
GPS_RX (in), GPS_TX (out)

### Nets
GND: C31.1 C32.1 D8.1(C) U19.3(GND) U19.8(GND) U19.11(GND) U19.12(GND) U19.13(GND)
VDD: L2.1 U19.4(VBACK)
NetC31_2: C31.2 C32.2 L2.2 U19.1(VCC)
NetD8_2: D8.2(A) R50.1
NetR48_1: R48.1 U19.10(RX)
NetR48_2: R48.2 ; port GPS_RX
NetR49_1: R49.1 U19.9(TX)
NetR49_2: R49.2 ; port GPS_TX
NetR50_2: R50.2 U19.5(3D-FIX)

Not connected (* = marked no-connect by the designer): U19 2(NC)* 6(1PPS)* 7(NC)*

### Notes on the sheet
- Project/Equipment
- Document
- Sensorbox
- Designer
- Drawn by
- Check.by
- Copyright Creotech Instruments SA 2014.
  This documentation describes Open Hardware and is licensed under the CERN OHL v.1.1. You may redistribute and modify this documentation under the terms of the CERN OHL v.1.1. (http://ohwr.org/CERNOHL). This documentation is distributed WITHOUT ANY EXPRESS OR IMPLIED WARRANTY, INCLUDING OF MERCHANTABILITY, SATISFACTORY QUALITY AND FITNESS FOR A PARTICULAR PURPOSE. Please see the CERN OHL v.1.1 for applicable conditions.
- CTI
- Creotech Instruments S.A.
- File
- Last Mod.
- Print Date
- Sheet
- Size
- A3
- of
- Rev
- (in symbol R0603_330R_1%_0.1W_100PPM) 1%

### Library data of the parts
C31 = CC0603_1UF_16V_10%_X7R: as C25 on sheet Supply; Part Number: CC0603_1UF_16V_10%_X7R; Component Kind: Standard; Component Type: Standard; Pin Count: 2; Value: 1uF; Status: Preferred; Manufacturer Part Number: CC0603_1uF_16V_10%_X7R; Case: 0603; Mounted: Yes; Socket: No; SMD: Yes; Manufacturer1 Example: PHYCOMP; Manufacturer1 ComponentHeight: 0.87mm; HelpURL: \\cern.ch\dfs\Applications\Altium\Datasheets\CC0805_X5R_PHYCOMP_HC.pdf; Author: CERN DEM JLC; CreateDate: 2007-12-03; LatestRevisionDate: 2007-12-03
C32 = CC0603_10NF_50V_10%_X7R: as C14 on sheet MCU_CONTROL; Part Number: CC0603_10NF_50V_10%_X7R; Component Kind: Standard; Component Type: Standard; Pin Count: 2; Value: 10nF; Status: Preferred; Manufacturer Part Number: CC0603_10NF_50V_10%_X7R; Case: 0603; Mounted: Yes; Socket: No; SMD: Yes; Manufacturer1 Example: PHYCOMP; Manufacturer1 ComponentHeight: 0.87mm; HelpURL: \\cern.ch\dfs\Applications\Altium\Datasheets\CC0603_X7R_PHYCOMP.pdf; Author: CERN DEM JLC; CreateDate: 2007-12-03; LatestRevisionDate: 2007-12-03
D8 = Diode
L2 = IND0402_MURATA_BLM15HB221SN1: Inductor; Part Number: MLB-100505-0600A; Part Description: SMD EMIFIL Suppression Chip Bead Ferrite; Manufacturer: MLB; Power: 200mA; Resistance: 1R; Tolerance: ±25%; Table: Inductors SMD; Component Kind: Standard; Component Type: Standard; Pin Count: 2; Value: 600R@100MHz; Status: None; Manufacturer Part Number: MLB-100505-0600A; Case: 0402; Mounted: Yes; Socket: No; SMD: Yes; ComponentHeight: 0.55mm; HelpURL: \\cern.ch\dfs\Applications\Altium\Datasheets\IND0402_MURATA_BLM15H.pdf; Author: CERN DEM JLC; CreateDate: 2009-06-23; LatestRevisionDate: 2009-06-23
R48-R50 = R0603_330R_1%_0.1W_100PPM: Resistor - 1%; Part Description: General Purpose Thick Film Chip Resistor; Manufacturer: GENERIC; Manufacturer1 Part Number: NRC06F3300TRF; Power: 0.1W; TC: ±100ppm/°C; Table: Resistors SMD; Part Number: R0603_330R_1%_0.1W_100PPM; Component Kind: Standard; Component Type: Standard; Pin Count: 2; Value: 330; Status: Preferred; Tolerance: ±1%; Manufacturer Part Number: R0603_330R_1%_0.1W_100PPM; Case: 0603; Mounted: Yes; Socket: No; SMD: Yes; Manufacturer1 Example: NIC COMPONENT; Manufacturer1 ComponentHeight: 0.55mm; HelpURL: \\cern.ch\dfs\Applications\Altium\Datasheets\R0603_NIC_NRC.pdf; Author: CERN DEM JLC; CreateDate: 2007-12-03; LatestRevisionDate: 2008-03-13
U19 = FGPMMOPA6C - GPS MODULE